# Altium schematic sheet TOP.SchDoc: =DocumentName
size A4
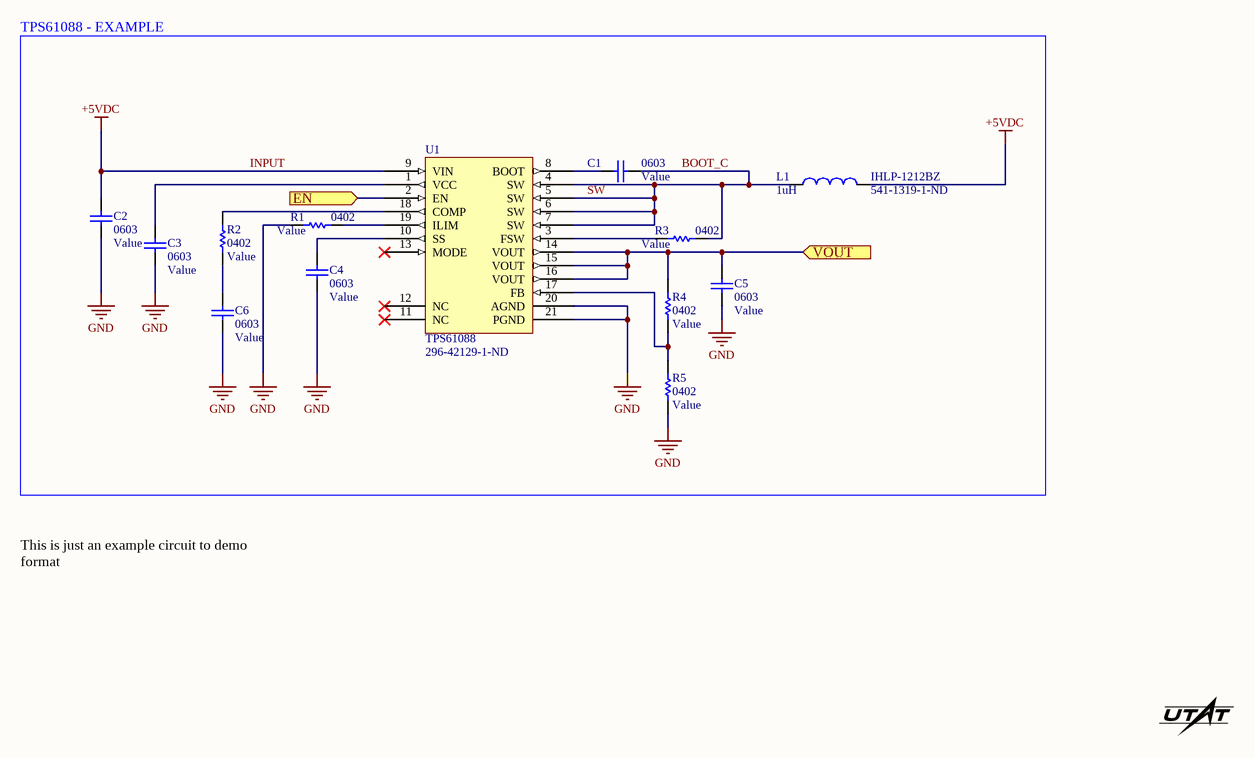
[diagram p0: TOP.SchDoc]

## Parts
C1  0603  [CAP0603R]
C2  0603  [CAP0603R]
C3  0603  [CAP0603R]
C4  0603  [CAP0603R]
C5  0603  [CAP0603R]
C6  0603  [CAP0603R]
L1  IHLP-1212BZ  Inductance: 1uH  Supplier Part Number 1: 541-1319-1-ND  [IHLP-1212BZ]
R1  0402  [RES0402R]
R2  0402  [RES0402R]
R3  0402  [RES0402R]
R4  0402  [RES0402R]
R5  0402  [RES0402R]
U1  TPS61088  Supplier Part Number 1: 296-42129-1-ND  [QFN50P450X350X100-21N]

## Blocks framed on the sheet
TPS61088 - EXAMPLE: C1-C6 L1 R1-R5 U1

## Ports
EN (in), VOUT (in)

## Nets
GND: C2.2 C3.1 C4.1 C5.1 C6.1 R1.1 R5.1 U1.20(AGND) U1.21(PGND)
INPUT: C2.1 L1.2 U1.9(VIN)  [also labelled +5VDC]
BOOT_C: C1.2 L1.1 R3.2 U1.4(SW) U1.5(SW) U1.6(SW) U1.7(SW)  [also labelled SW]
EN: U1.2(EN) ; port EN
VOUT: C5.2 R4.2 U1.14(VOUT) U1.15(VOUT) U1.16(VOUT) ; port VOUT
NetC1_1: C1.1 U1.8(BOOT)
NetC3_2: C3.2 U1.1(VCC)
NetC4_2: C4.2 U1.10(SS)
NetC6_2: C6.2 R2.1
NetR1_2: R1.2 U1.19(ILIM)
NetR2_2: R2.2 U1.18(COMP)
NetR3_1: R3.1 U1.3(FSW)
NetR4_1: R4.1 R5.2 U1.17(FB)

Not connected (* = marked no-connect by the designer): U1 11(NC)* 12(NC)* 13(MODE)*

## Notes on the sheet
- This is just an example circuit to demo format

## Library data of the parts
C1-C6 = CAP0603: 0603 capacitor; Value: Value
L1 = IND_IHLP-1212BZ: 1µH Shielded Molded Inductor 5A 24mOhm Max Nonstandard; Manufacturer: Vishay Dale; Manufacturer Part Number: IHLP1212BZER1R0M11; Core Material: Metal,Composite; Self Resonant Frequency: 75MHz; Saturation Current: 4.5A; Tolerance: 20%; DC Resistance (DCR): 24mR; Test Frequency: 100kHz; Supplier 1: Digi-Key; Stock 1: 196362; Pricing 1: 1=1.45, 10=1.346, 100=0.9729, 500=0.7452, 1000=0.6624 (USD); Mount: Surface Mount; Case/Package: 1212; Number of Pins: 2; Case Code (Metric): 3630; Case Code (Imperial): 1212; Contact Plating: Tin; Min Operating Temperature: -55°C; Max Operating Temperature: 125°C; Shielding: Shielded; Packaging: Tape and Reel; Package Quantity: 3000; Current Rating: 5A; Inductance Tolerance: 20%; Max DC Current: 5A; Termination: SMD/SMT; RMS Current (Irms): 5A; Military Standard: Not; Length: 3.6mm; Height: 2mm; Width: 0.118inch; Height - Seated (Max): 0.079inch; Depth: 3.2mm; Radiation Hardening: No; REACH SVHC: Unknown; Lead Free: Lead Free; ComponentLink1URL: http://www.mouser.com/ds/2/427/lp12bz11-244380.pdf?src-supplier=Mouser; ComponentLink1Description: http://www.mouser.com/ds/2/427/lp12bz11-244380.pdf?src-supplier=Mouser; ComponentLink2URL: http://www.vishay.com/docs/34289/lp12bz11.pdf?src-supplier=Digi-Key; ComponentLink2Description: http://www.vishay.com/docs/34289/lp12bz11.pdf?src-supplier=Digi-Key; ComponentLink3URL: http://www.vishay.com/docs/34289/lp12bz11.pdf?src-supplier=Avnet; ComponentLink3Description: http://www.vishay.com/docs/34289/lp12bz11.pdf?src-supplier=Avnet; ComponentLink4URL: http://www.farnell.com/datasheets/652599.pdf?src-supplier=Element14; ComponentLink4Description: http://www.farnell.com/datasheets/652599.pdf?src-supplier=Element14; ComponentLink5URL: http://www.vishay.com/docs/34289/lp12bz11.pdf?src-supplier=Avnet+Europe; ComponentLink5Description: http://www.vishay.com/docs/34289/lp12bz11.pdf?src-supplier=Avnet+Europe; ComponentLink6URL: https://www.verical.com/server-webapp/html/getDatasheet?partID=180380&src-supplier=Verical; ComponentLink6Description: https://www.verical.com/server-webapp/html/getDatasheet?partID=180380&src-supplier=Verical
R1-R5 = RES0402: 0402 resistor; Value: Value
U1 = TPS61088: Boost converter; Supplier 1: Digi-Key